# Altium project BTL_test_1.PrjPcb
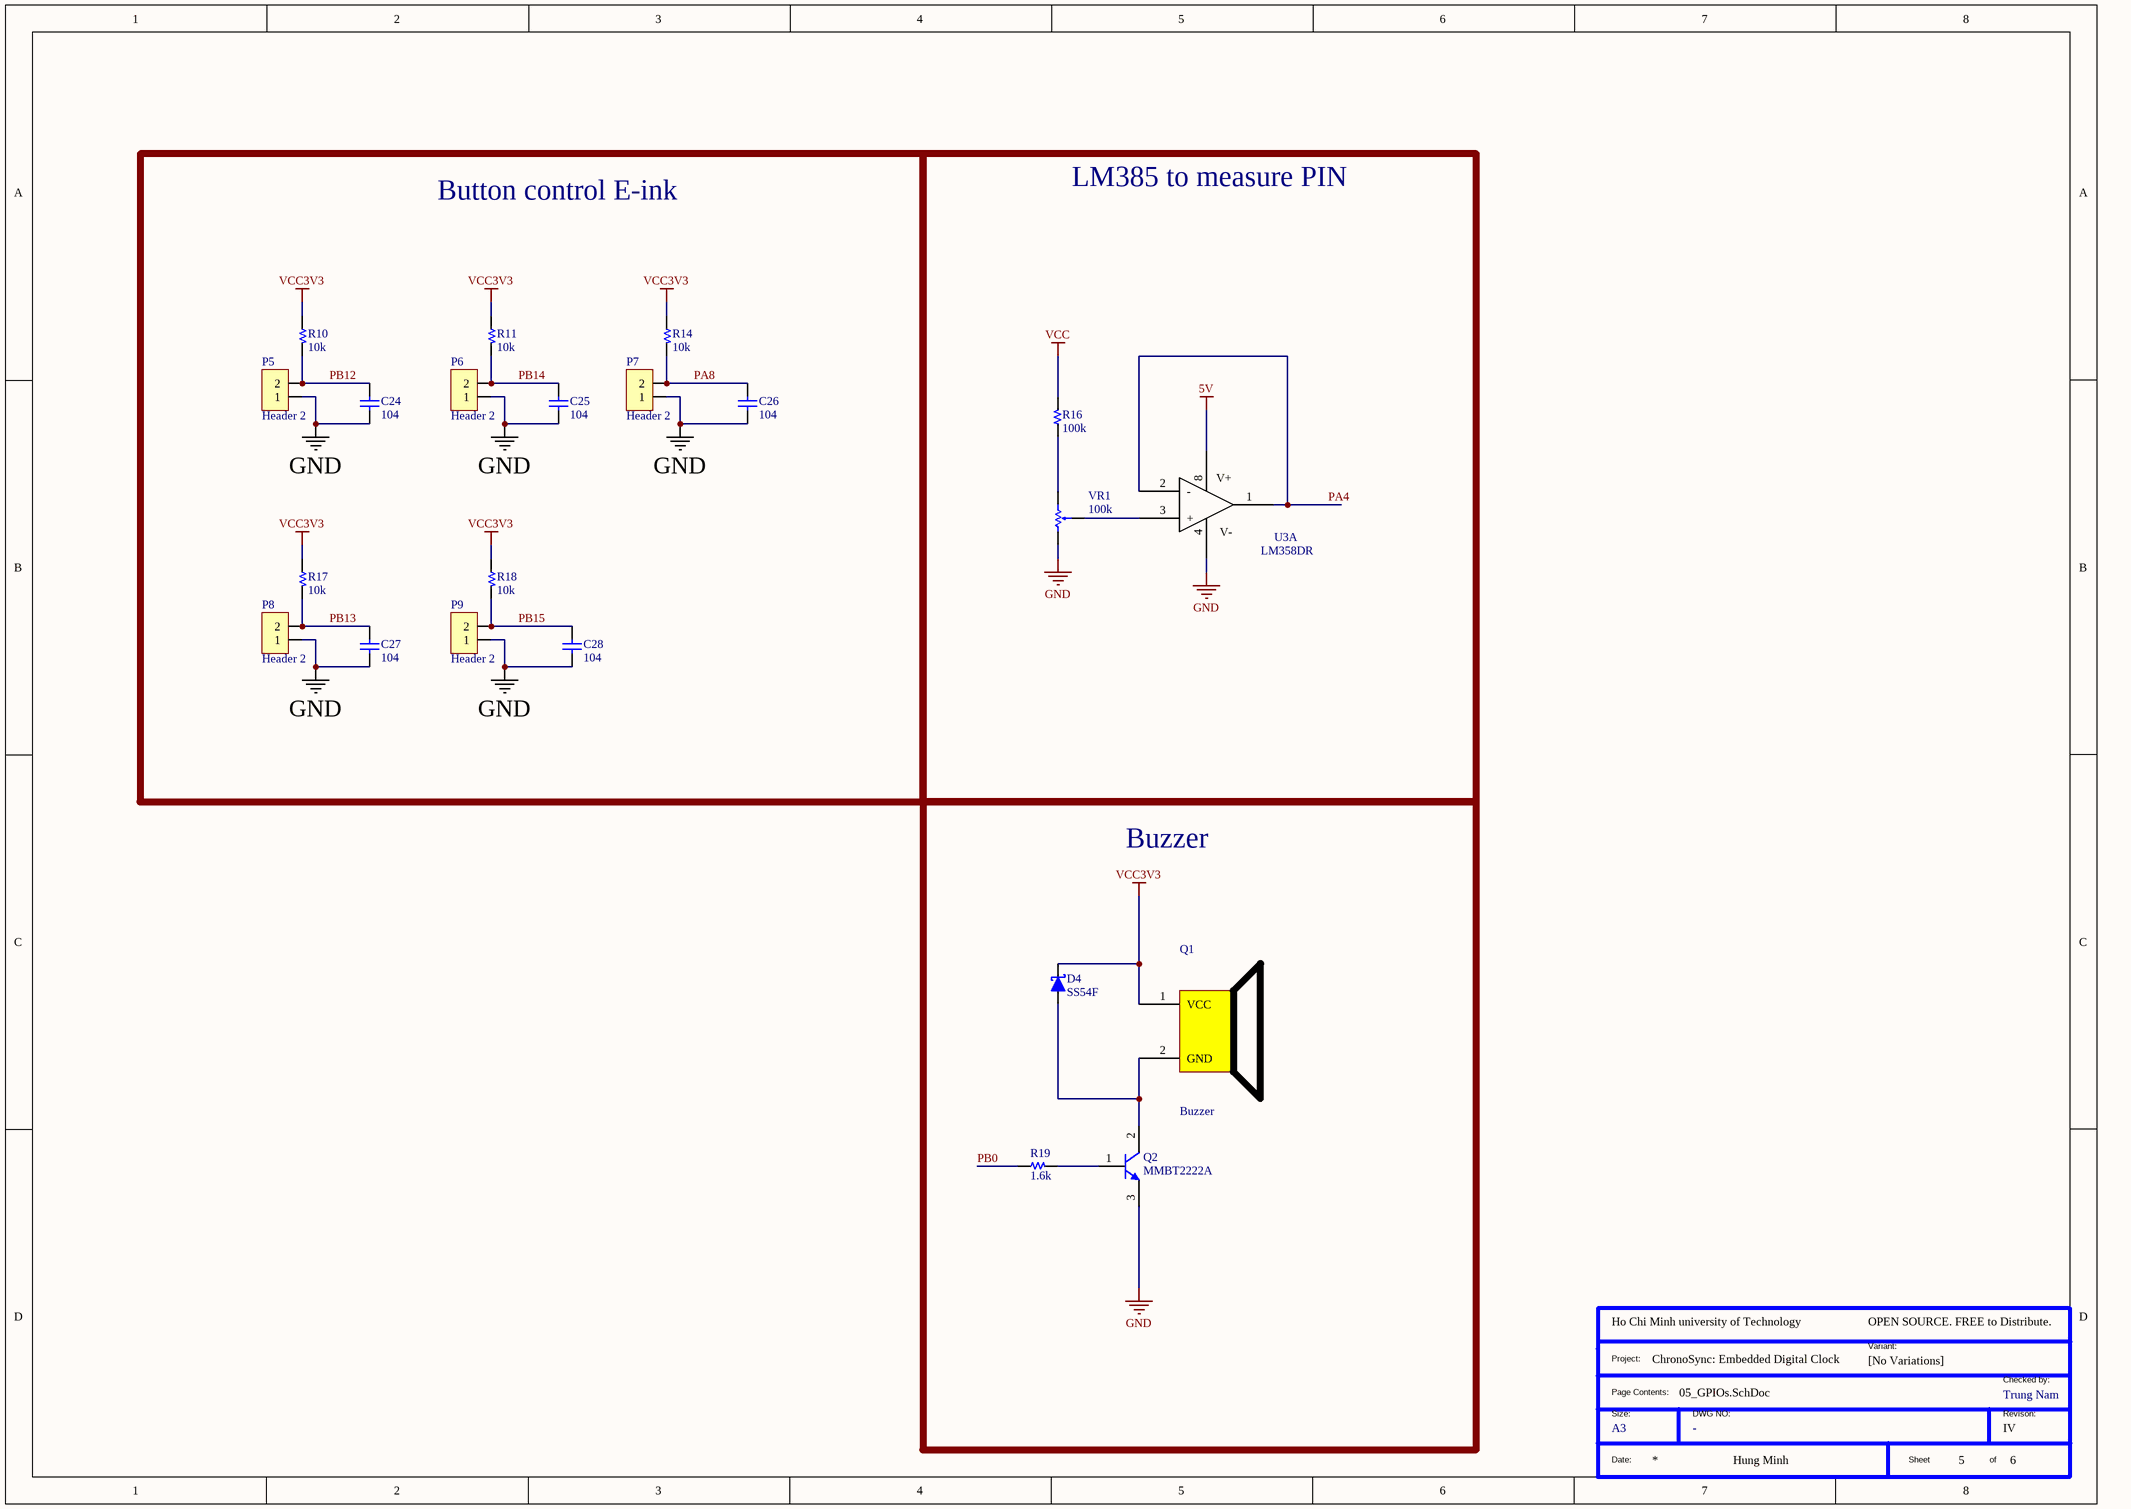
[diagram p0: 05_GPIOs.SchDoc]
VersionRevision: IV; Project: ChronoSync: Embedded Digital Clock; DesignedByURL: Hung Minh; Company: Ho Chi Minh university of Technology
1 sheet, 23 parts. Net scope: global (net labels, ports and power ports of the same name join across sheets).
Board file: final_version.PcbDoc

## Sheet 05_GPIOs.SchDoc
size A3; SheetNumber: 5; SheetTotal: 6

### Parts
*?  Size: A3  Checked by: Trung Nam  (hidden comment: TitleBlock)  (graphical)
C24  104  [C 0805]
C25  104  [C 0805]
C26  104  [C 0805]
C27  104  [C 0805]
C28  104  [C 0805]
D4  SS54F  [DO-214AC (SMA)]
P5  Header 2  [HDR/Header/2/BOX/RED]
P6  Header 2  [HDR/Header/2/BOX/RED]
P7  Header 2  [HDR/Header/2/BOX/RED]
P8  Header 2  [HDR/Header/2/BOX/RED]
P9  Header 2  [HDR/Header/2/BOX/RED]
Q1  Buzzer  [9056-TS Buzzer]
Q2  MMBT2222A  [MMBT-SOT23]
R10  10k  [R 0805]
R11  10k  [R 0805]
R14  10k  [R 0805]
R16  100k  [R 0805]
R17  10k  [R 0805]
R18  10k  [R 0805]
R19  1.6k  [R 0805]
U3  LM358DR  [LM358DR]  (part A of 2)
VR1  100k  [R VAR E]

### Blocks framed on the sheet
Button control E-ink: C24-C28 P5-P9 R10 R11 R14 R17 R18
LM385 to measure PIN: R16 U3 VR1
Buzzer: D4 Q1 Q2 R19

### Nets
5V: U3.8(VCC)
GND: C24.2 C25.2 C26.2 C27.2 C28.2 P5.1 P6.1 P7.1 P8.1 P9.1 Q2.3(E) U3.4(GND) VR1.3
VCC: R16.2
VCC3V3: D4.2(K) Q1.1(VCC) R10.1 R11.1 R14.1 R17.1 R18.1
PA4: U3.1(OUT_1) U3.2(-)
PA8: C26.1 P7.2 R14.2
PB0: R19.1
PB12: C24.1 P5.2 R10.2
PB13: C27.1 P8.2 R17.2
PB14: C25.1 P6.2 R11.2
PB15: C28.1 P9.2 R18.2
NetD4_1: D4.1(A) Q1.2(GND) Q2.2(C)
NetQ2_1: Q2.1(B) R19.2
NetR16_1: R16.1 VR1.1
NetU3_3: U3.3(+) VR1.2

### Notes on the sheet
- (in symbol LM358DR, part A) V+; V-
- (in symbol TitleBlock) OPEN SOURCE. FREE to Distribute.; Project:; Variant:; [No Variations]; Checked by:; Page Contents:; Size:; DWG NO:; Revison:; Date:; Sheet; of

### Library data of the parts
*? = TitleBlock: Standard Title Block; DWG NO: -
C24-C28 = Capacitor NP: Capacitor non-pol
D4 = Diode Schottky: Schottky Diode
P5-P9 = Header 2: Header, 2-Pin
Q1 = 9056-TS Buzzer
Q2 = MMBT2222A: TRANS NPN, 40V, 600MA, SOT23-3; Manufacturer: Diotec Semiconductor; DC Current Gain: 35-300; Gain Bandwidth Product fT: 250MHz; Power Dissipation: 250mW; Configuration: Single; Current - Collector: 600mA; Supplier 1 URL: https://www.mouser.vn/ProductDetail/Diotec-Semiconductor/MMBT2222A?qs=OlC7AqGiEDl9N1c3%252BL%2F%252Brw%3D%3D; Supplier 2 URL: https://www.digikey.com/en/products/detail/diotec-semiconductor/MMBT2222A/13163394; Supplier 3 URL: https://www.thegioiic.com/mmbt2222a-transistor-npn-40v-0-6a-3-chan-sot-23; Voltage - Collector Emitter Breakdown: 40V; Value: MMBT2222A; ComponentLink1Description: Datasheet; ComponentLink1URL: https://www.mouser.vn/datasheet/2/849/mmbt2222-3324676.pdf; Manufacturer Part Number: MMBT2222A; Mount: SMD/SMT; Operating Temperature Max: + 150 C; Operating Temperature Min: - 55 C; Package / Case: SOT-23; Packaging: Tape and Reel; Supplier 1: Mouser; Supplier 1 Part Number: 637-MMBT2222A; Supplier 2: Digi-Key; Supplier 2 Part Number: 2796-MMBT2222ATR-ND; Supplier 3: thegioiic; Supplier 3 Part Number: N/A; Transistor Polarity: NPN; LCSC Part #: C94515
R10 R11 R14 R16-R19 = Resistor
U3 = LM358DR: Operational Amplifiers - Op Amps Dual Op Amp; Manufacturer: Texas Instruments; Active Read Current - Max: Active; CMRR - Common Mode Rejection Ratio: 80 dB; Dual Supply Voltage: +/- 3 V, +/- 5 V, +/- 9 V; GBP - Gain Bandwidth Product: 700 kHz; Ib - Input Bias Current: 250 nA; Number of Channels: 2 Channel; Operating Supply Current: 350 uA; Output Current per Channel: 20 mA; SR - Slew Rate: 300 mV/us; Supply Voltage - Max: 32 V; Supply Voltage - Min: 3 V; Voltage Gain dB: 100 dB; Vos - Input Offset Voltage: 7 mV; Supplier 1 URL: https://www.mouser.com/ProductDetail/Texas-Instruments/LM358DR?qs=Zu35EjizYSSY6pJ37yjmHA%3D%3D; Supplier 2 URL: N/A; Supplier 3 URL: N/A; Value: LM358DR; Manufacturer Part Number: LM358DR; Supplier 1: Mouser; Supplier 1 Part Number: 595-LM358DR; Supplier 2: Digi-Key; Supplier 2 Part Number: N/A; Supplier 3: thegioiic; Supplier 3 Part Number: N/A; Mount: SMD/SMT; Operating Temperature Max: + 85 C; Operating Temperature Min: - 40 C; Package / Case: SOIC-8; Packaging: Tape and Reel; ComponentLink1Description: Datasheet; ComponentLink1URL: https://www.ti.com/general/docs/suppproductinfo.tsp?distId=26&gotoUrl=https://www.ti.com/lit/gpn/lm358; LCSC Part #: C5423
VR1 = Resistor Variable